# Altium schematic sheet LoRa.SchDoc: LoRa
size A; Author: Craig Hesling; DrawnBy: Craig Hesling; Revision: 1
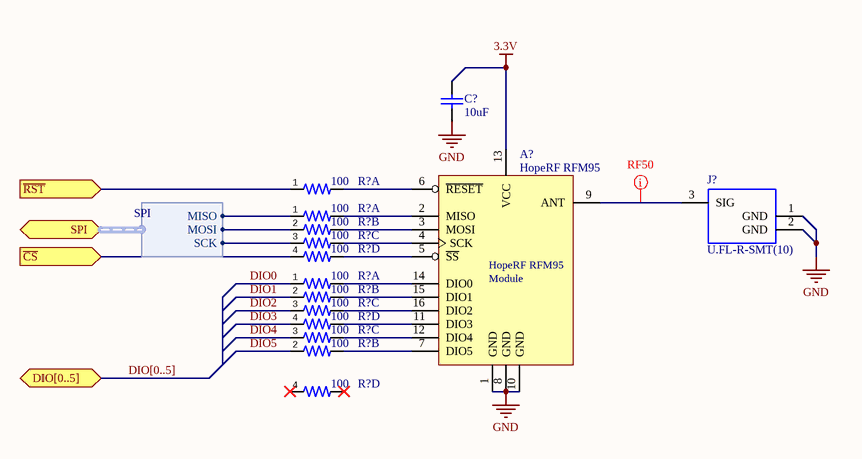
[diagram p0: LoRa.SchDoc]

## Parts
(Parts that share a designator on the sheet are numbered #1, #2 ... from top to bottom, then left to right.)
A?  HopeRF RFM95  [RFM95/9697/98W]
C?  10uF  [CAPC2013X14L - CAP0805 1.45mm Tall]
J?  U.FL-R-SMT(10)  [HRS-U.FL-R-SMT_V]
R?#1  100  [CAC-80P319X159-8L]  (part A of 4)
R?#2  100  [CAC-80P319X159-8L]  (part A of 4)
R?#3  100  [CAC-80P319X159-8L]  (part B of 4)
R?#4  100  [CAC-80P319X159-8L]  (part C of 4)
R?#5  100  [CAC-80P319X159-8L]  (part D of 4)
R?#6  100  [CAC-80P319X159-8L]  (part A of 4)
R?#7  100  [CAC-80P319X159-8L]  (part B of 4)
R?#8  100  [CAC-80P319X159-8L]  (part C of 4)
R?#9  100  [CAC-80P319X159-8L]  (part D of 4)
R?#10  100  [CAC-80P319X159-8L]  (part C of 4)
R?#11  100  [CAC-80P319X159-8L]  (part B of 4)
R?#12  100  [CAC-80P319X159-8L]  (part D of 4)

## Ports
DIO[0..5] (bidir), SPI (harness SPI), ~{CS} (in), ~{RST} (in)

## Harnesses
SPI: MISO, MOSI, SCK

## Nets
3.3V: A?.13(VCC) C?.2
GND: A?.1(GND) A?.8(GND) A?.10(GND) C?.1 J?.1(GND) J?.2(GND)
~{CS}: R?#5.4 ; port ~{CS}
DIO0: R?#6.1
DIO1: R?#7.2
DIO2: R?#8.3
DIO3: R?#9.4
DIO4: R?#10.3
DIO5: R?#11.2
~{RST}: R?#1.1 ; port ~{RST}
NetA?_2: A?.2(MISO) R?#2.5
NetA?_3: A?.3(MOSI) R?#3.6
NetA?_4: A?.4(SCK) R?#4.7
NetA?_5: A?.5(~{SS}) R?#5.8
NetA?_6: A?.6(~{RESET}) R?#1.5
NetA?_7: A?.7(DIO5) R?#11.6
NetA?_9: A?.9(ANT) J?.3(SIG)
NetA?_11: A?.11(DIO3) R?#9.8
NetA?_12: A?.12(DIO4) R?#10.7
NetA?_14: A?.14(DIO0) R?#6.5
NetA?_15: A?.15(DIO1) R?#7.6
NetA?_16: A?.16(DIO2) R?#8.7
NetR?#2_1: R?#2.1 ; port SPI.MISO
NetR?#3_2: R?#3.2 ; port SPI.MOSI
NetR?#4_3: R?#4.3 ; port SPI.SCK

Not connected (* = marked no-connect by the designer): R?#12 4* 8*

## Buses and harness runs
bus DIO[0..5] = port DIO[0..5]

## Layout directives
net class RF50: NetA?_9

## Notes on the sheet
- (in symbol RFM95) Module

## Library data of the parts
A? = RFM95: HopeRF RFM95 915MHz LoRa Radio; Supplier 1: Digi-Key; Supplier 2: Digi-Key; Supplier Part Number 1: 1597-1488-ND; Supplier Part Number 2: RFM95W-915S2-ND
C? = CAP0805 10uF 10% 6.3V X5R: SMT 0805 Ceramic Capacitor; TempCoeff: X5R; Tolerance: 10%; Voltage: 6.3V; Value: 10uF; Supplier 1: Digi-Key; Supplier Part Number 1: 1276-6457-1-ND
J? = CMP-0029-00003-1: Ultra Small Surface Mount Coaxial Connector, 50 Ohm, -40 to 90 degC, 3-Pin SMD, RoHS, Tape and Reel; Current Rating: 3 A; DatasheetVersion: Aug-16; Mount: Through Hole; Contact Material: Bronze; Length: 101.19 mm; Radiation Hardening: No; Height: 8.13 mm; ComponentLink1Description: Manufacturer URL; Pins: 80; Package Quantity: 50; ComponentLink2URL: https://www.hirose.com/product/en/download_file/key_name/U.FL/category/Catalog/doc_file_id/31697/?file_category_id=4&item_id=15&is_series=1; Lead Pitch: 2.54 mm; Max Operating Temperature: 105degC; Width: 4.88 mm; RoHSCompliant: True; Contact Plating: Tin; PackageReference: U.FL-R-SMT; Packaging: Bulk; Contact Finish: Lead; PackageDescription: 3-Pin Surface Mount Device, Body 2.6 x 2.6 mm; Min Operating Temperature: -65degC; ComponentLink1URL: https://www.hirose.com; ComponentLink2Description: Datasheet; Colour: Black
R?#1-R?#12 = RESARR1206 100 5% 1/16W: Tolerance: 5%; Power: 1/16W; Supplier 1: Digi-Key; Supplier Part Number 1: YC164J-100CT-ND; Value: 100